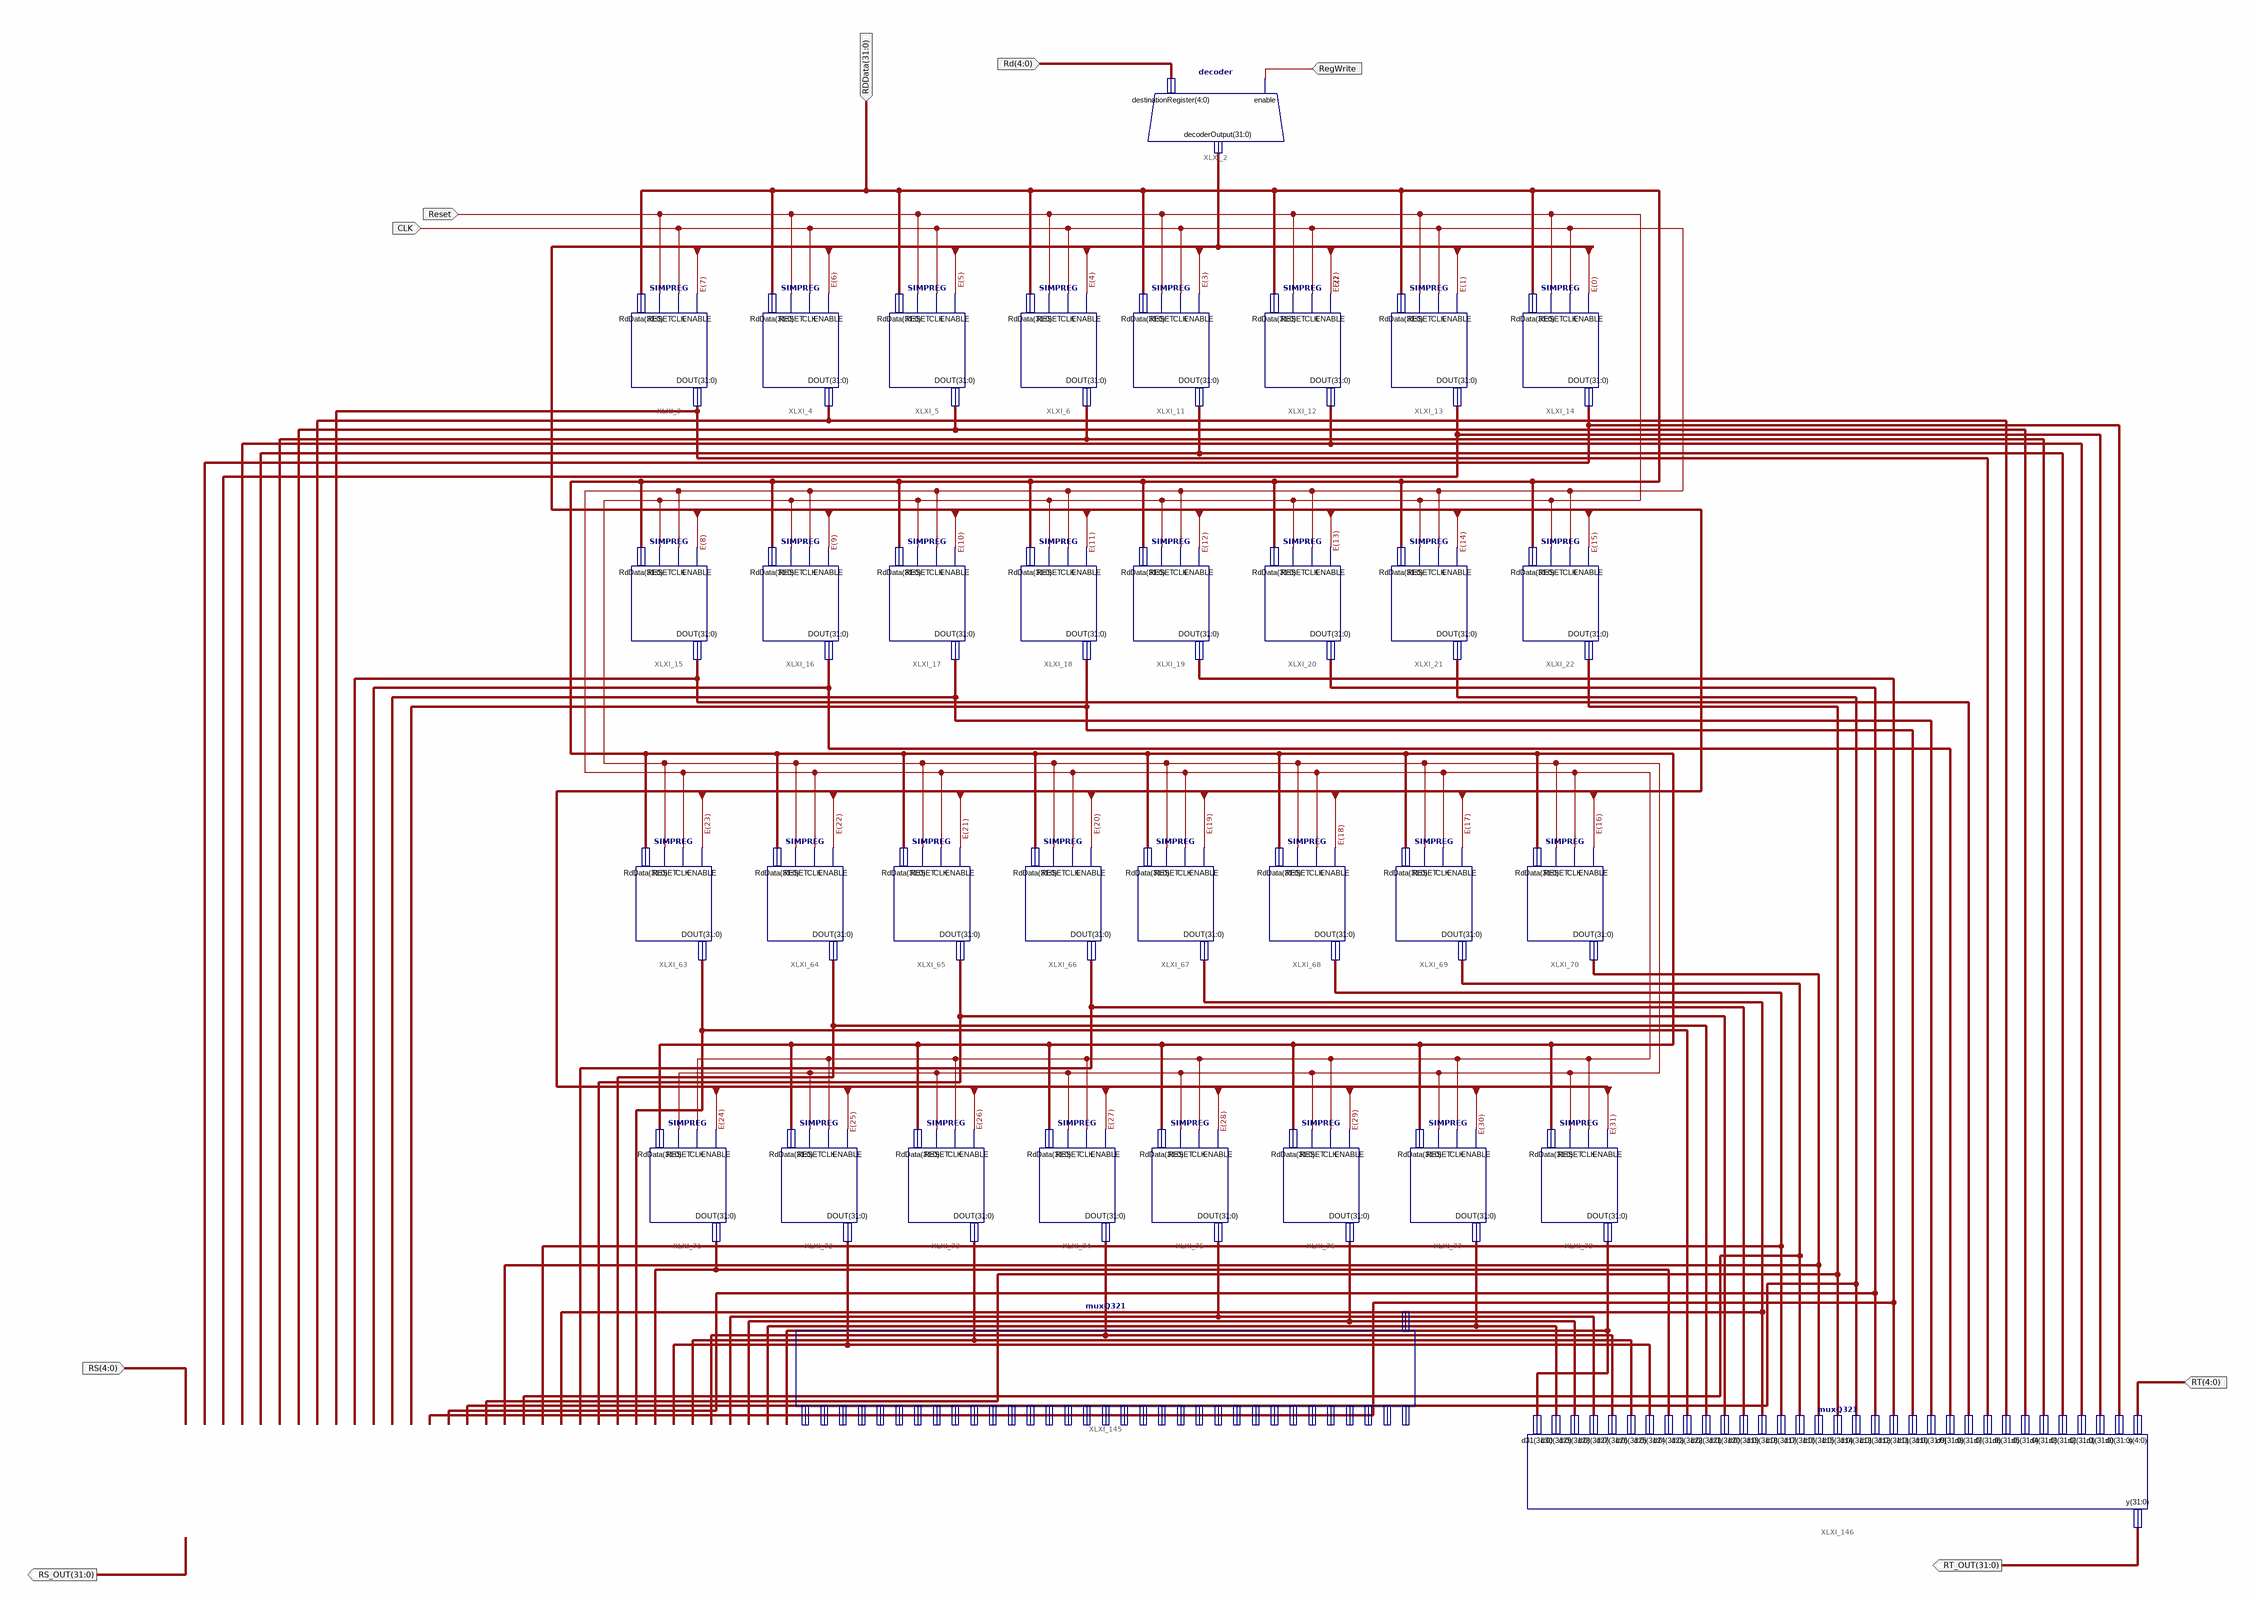
[diagram p0: schematic sheet 1]
// Xilinx ISE schematic RegisterFile.sch (artix7) as structural Verilog: 35 symbols, 9 ports
module RegisterFile (
  input  [31:0] RDData,
  input  CLK,
  input  Reset,
  input  [4:0] RS,
  input  [4:0] RT,
  input  [4:0] Rd,
  input  RegWrite,
  output [31:0] RS_OUT,
  output [31:0] RT_OUT
);

  wire [31:0] E, XLXN_839, XLXN_853, XLXN_854, XLXN_856, XLXN_858, XLXN_859, XLXN_860, XLXN_862, XLXN_865,
       XLXN_869, XLXN_870, XLXN_872, XLXN_911, XLXN_914, XLXN_915, XLXN_916, XLXN_917, XLXN_931, XLXN_932,
       XLXN_933, XLXN_934, XLXN_938, XLXN_939, XLXN_940, XLXN_941, XLXN_946, XLXN_947, XLXN_948, XLXN_949,
       XLXN_950, XLXN_951, XLXN_952;

  muxQ321 XLXI_145 (
    .s(RS), .d0(XLXN_914), .d1(XLXN_915), .d2(XLXN_916), .d3(XLXN_917), .d4(XLXN_950), .d5(XLXN_951),
    .d6(XLXN_952), .d7(XLXN_839), .d8(XLXN_853), .d9(XLXN_854), .d10(XLXN_911), .d11(XLXN_856),
    .d12(XLXN_858), .d13(XLXN_859), .d14(XLXN_860), .d15(XLXN_862), .d16(XLXN_865), .d17(XLXN_869),
    .d18(XLXN_870), .d19(XLXN_872), .d20(XLXN_934), .d21(XLXN_933), .d22(XLXN_932), .d23(XLXN_931),
    .d24(XLXN_949), .d25(XLXN_948), .d26(XLXN_947), .d27(XLXN_946), .d28(XLXN_941), .d29(XLXN_940),
    .d30(XLXN_939), .d31(XLXN_938), .y(RS_OUT));
  muxQ321 XLXI_146 (
    .s(RT), .d0(XLXN_914), .d1(XLXN_915), .d2(XLXN_916), .d3(XLXN_917), .d4(XLXN_950), .d5(XLXN_951),
    .d6(XLXN_952), .d7(XLXN_839), .d8(XLXN_853), .d9(XLXN_854), .d10(XLXN_911), .d11(XLXN_856),
    .d12(XLXN_858), .d13(XLXN_859), .d14(XLXN_860), .d15(XLXN_862), .d16(XLXN_865), .d17(XLXN_869),
    .d18(XLXN_870), .d19(XLXN_872), .d20(XLXN_934), .d21(XLXN_933), .d22(XLXN_932), .d23(XLXN_931),
    .d24(XLXN_949), .d25(XLXN_948), .d26(XLXN_947), .d27(XLXN_946), .d28(XLXN_941), .d29(XLXN_940),
    .d30(XLXN_939), .d31(XLXN_938), .y(RT_OUT));
  SIMPREG XLXI_15 (.ENABLE(E[8]), .CLK(CLK), .RESET(Reset), .RdData(RDData), .DOUT(XLXN_853));
  SIMPREG XLXI_66 (.ENABLE(E[20]), .CLK(CLK), .RESET(Reset), .RdData(RDData), .DOUT(XLXN_934));
  SIMPREG XLXI_69 (.ENABLE(E[17]), .CLK(CLK), .RESET(Reset), .RdData(RDData), .DOUT(XLXN_869));
  SIMPREG XLXI_68 (.ENABLE(E[18]), .CLK(CLK), .RESET(Reset), .RdData(RDData), .DOUT(XLXN_870));
  SIMPREG XLXI_67 (.ENABLE(E[19]), .CLK(CLK), .RESET(Reset), .RdData(RDData), .DOUT(XLXN_872));
  SIMPREG XLXI_65 (.ENABLE(E[21]), .CLK(CLK), .RESET(Reset), .RdData(RDData), .DOUT(XLXN_933));
  SIMPREG XLXI_64 (.ENABLE(E[22]), .CLK(CLK), .RESET(Reset), .RdData(RDData), .DOUT(XLXN_932));
  SIMPREG XLXI_63 (.ENABLE(E[23]), .CLK(CLK), .RESET(Reset), .RdData(RDData), .DOUT(XLXN_931));
  SIMPREG XLXI_70 (.ENABLE(E[16]), .CLK(CLK), .RESET(Reset), .RdData(RDData), .DOUT(XLXN_865));
  decoder XLXI_2 (.enable(RegWrite), .decoderOutput(E), .destinationRegister(Rd));
  SIMPREG XLXI_22 (.ENABLE(E[15]), .CLK(CLK), .RESET(Reset), .RdData(RDData), .DOUT(XLXN_862));
  SIMPREG XLXI_21 (.ENABLE(E[14]), .CLK(CLK), .RESET(Reset), .RdData(RDData), .DOUT(XLXN_860));
  SIMPREG XLXI_20 (.ENABLE(E[13]), .CLK(CLK), .RESET(Reset), .RdData(RDData), .DOUT(XLXN_859));
  SIMPREG XLXI_19 (.ENABLE(E[12]), .CLK(CLK), .RESET(Reset), .RdData(RDData), .DOUT(XLXN_858));
  SIMPREG XLXI_18 (.ENABLE(E[11]), .CLK(CLK), .RESET(Reset), .RdData(RDData), .DOUT(XLXN_856));
  SIMPREG XLXI_16 (.ENABLE(E[9]), .CLK(CLK), .RESET(Reset), .RdData(RDData), .DOUT(XLXN_854));
  SIMPREG XLXI_14 (.ENABLE(E[0]), .CLK(CLK), .RESET(Reset), .RdData(RDData), .DOUT(XLXN_914));
  SIMPREG XLXI_13 (.ENABLE(E[1]), .CLK(CLK), .RESET(Reset), .RdData(RDData), .DOUT(XLXN_915));
  SIMPREG XLXI_12 (.ENABLE(E[2]), .CLK(CLK), .RESET(Reset), .RdData(RDData), .DOUT(XLXN_916));
  SIMPREG XLXI_11 (.ENABLE(E[3]), .CLK(CLK), .RESET(Reset), .RdData(RDData), .DOUT(XLXN_917));
  SIMPREG XLXI_6 (.ENABLE(E[4]), .CLK(CLK), .RESET(Reset), .RdData(RDData), .DOUT(XLXN_950));
  SIMPREG XLXI_5 (.ENABLE(E[5]), .CLK(CLK), .RESET(Reset), .RdData(RDData), .DOUT(XLXN_951));
  SIMPREG XLXI_4 (.ENABLE(E[6]), .CLK(CLK), .RESET(Reset), .RdData(RDData), .DOUT(XLXN_952));
  SIMPREG XLXI_3 (.ENABLE(E[7]), .CLK(CLK), .RESET(Reset), .RdData(RDData), .DOUT(XLXN_839));
  SIMPREG XLXI_72 (.ENABLE(E[25]), .CLK(CLK), .RESET(Reset), .RdData(RDData), .DOUT(XLXN_948));
  SIMPREG XLXI_73 (.ENABLE(E[26]), .CLK(CLK), .RESET(Reset), .RdData(RDData), .DOUT(XLXN_947));
  SIMPREG XLXI_74 (.ENABLE(E[27]), .CLK(CLK), .RESET(Reset), .RdData(RDData), .DOUT(XLXN_946));
  SIMPREG XLXI_75 (.ENABLE(E[28]), .CLK(CLK), .RESET(Reset), .RdData(RDData), .DOUT(XLXN_941));
  SIMPREG XLXI_76 (.ENABLE(E[29]), .CLK(CLK), .RESET(Reset), .RdData(RDData), .DOUT(XLXN_940));
  SIMPREG XLXI_77 (.ENABLE(E[30]), .CLK(CLK), .RESET(Reset), .RdData(RDData), .DOUT(XLXN_939));
  SIMPREG XLXI_78 (.ENABLE(E[31]), .CLK(CLK), .RESET(Reset), .RdData(RDData), .DOUT(XLXN_938));
  SIMPREG XLXI_71 (.ENABLE(E[24]), .CLK(CLK), .RESET(Reset), .RdData(RDData), .DOUT(XLXN_949));
  SIMPREG XLXI_17 (.ENABLE(E[10]), .CLK(CLK), .RESET(Reset), .RdData(RDData), .DOUT(XLXN_911));
endmodule
